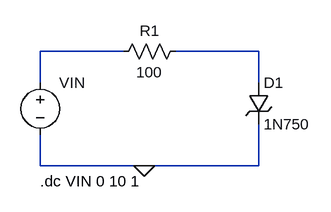
[diagram p0: schematic 2EEB_VELASCO_EXPT5_CKT3.asc]
2EEB_VELASCO_EXPT5_CKT3.asc, the LTspice schematic file:
Version 4
SHEET 1 880 680
WIRE 224 64 96 64
WIRE 432 64 304 64
WIRE 96 112 96 64
WIRE 432 112 432 64
WIRE 96 240 96 192
WIRE 256 240 96 240
WIRE 432 240 432 176
WIRE 432 240 256 240
FLAG 256 240 0
SYMBOL voltage 96 96 R0
WINDOW 0 69 16 Right 2
WINDOW 123 0 0 Left 0
WINDOW 39 0 0 Left 0
SYMATTR InstName VIN
SYMATTR Value ""
SYMBOL res 320 48 R90
WINDOW 0 0 56 VBottom 2
WINDOW 3 32 56 VTop 2
SYMATTR InstName R1
SYMATTR Value 100
SYMBOL zener 416 112 R0
SYMATTR InstName D1
SYMATTR Value 1N750
TEXT 96 264 Left 2 !.dc VIN 0 10 1

The netlist it stands for:
* 2EEB_VELASCO_EXPT5_CKT3.asc
VIN N001 0
R1 N002 N001 100
D1 N002 0 1N750
.model D D
.lib standard.dio
.dc VIN 0 10 1
.backanno
.end